# EAGLE schematic motor-shield01 (EAGLE 7.5.0)
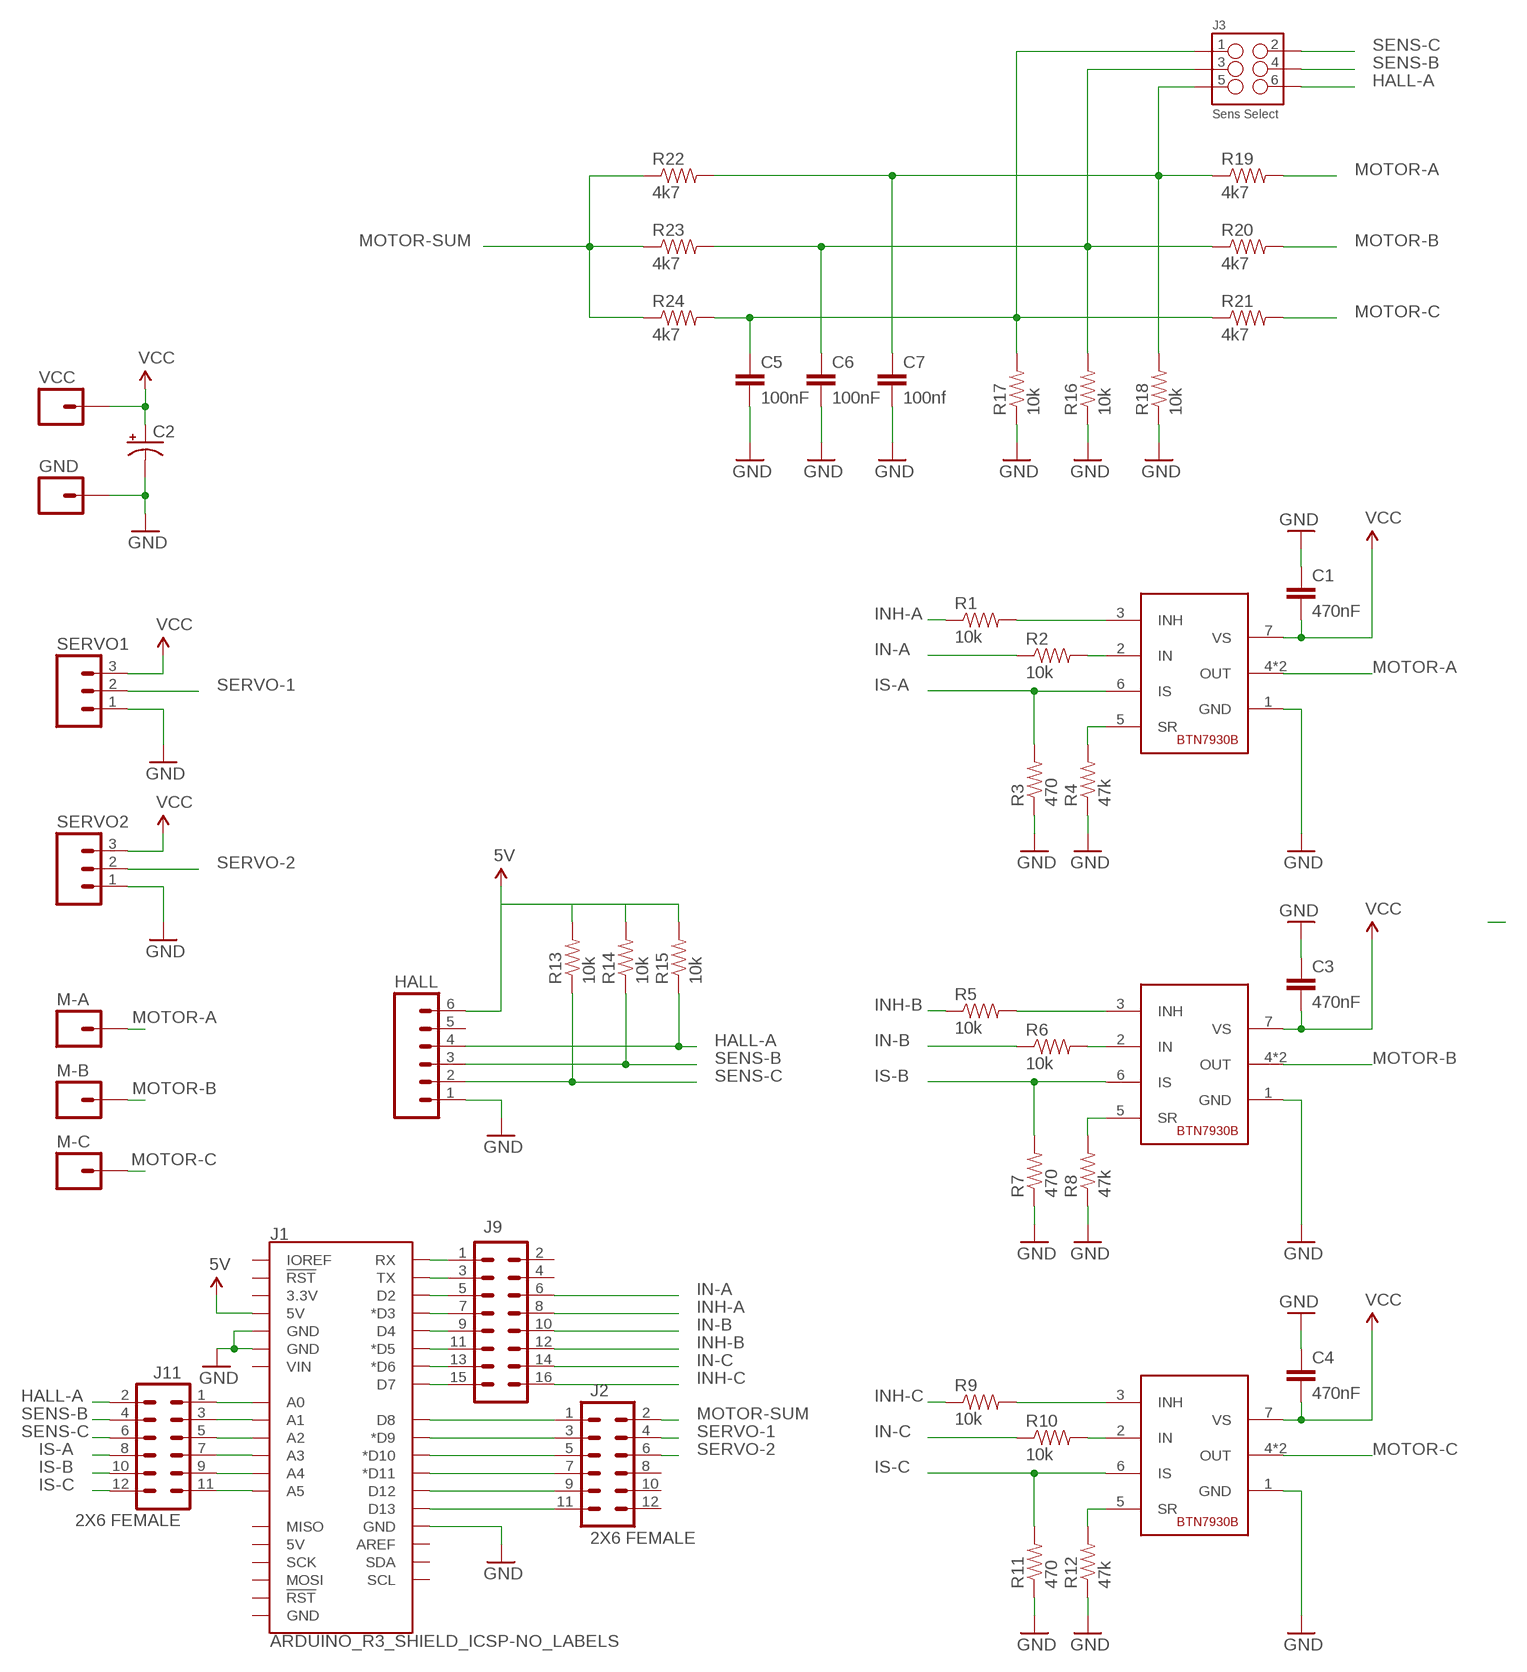
[diagram p0: schematic, sheet 1]

## Parts
C1  470nF  CAPEZ  [CAP-PTH-SMALLEZ]
C2  CAP_POLPTH1  [CPOL-RADIAL-100UF-25V]
C3  470nF  CAPEZ  [CAP-PTH-SMALLEZ]
C4  470nF  CAPEZ  [CAP-PTH-SMALLEZ]
C5  100nF  CAPEZ  [CAP-PTH-SMALLEZ]
C6  100nF  CAPEZ  [CAP-PTH-SMALLEZ]
C7  100nf  CAPEZ  [CAP-PTH-SMALLEZ]
DA  H-Bridge  INF-PG-TO263-7-1_L_1  [INF-PG-TO263-7-1_L_1PRIMARY]
DB  H-Bridge  INF-PG-TO263-7-1_L_1  [INF-PG-TO263-7-1_L_1PRIMARY]
DC  H-Bridge  INF-PG-TO263-7-1_L_1  [INF-PG-TO263-7-1_L_1PRIMARY]
GND  M01SMTRA-256-8-6  [SMTRA-256-8-6]
HALL  M06SMD-1MM  [1X06-1MM]
J1  ARDUINO_R3_SHIELD_ICSP-NO_LABELS  [UNO_R3_SHIELD_ICSP_NOLABELS]
J2  2X6 FEMALE  M06X2PTH_FEMALE  [2X6]
J3  Sens Select  M03X2FEMALE  [2X3]
J9  M08X2  [2X8]
J11  2X6 FEMALE  M06X2PTH_FEMALE  [2X6]
M-A  M01SMTRA-256-8-6  [SMTRA-256-8-6]
M-B  M01SMTRA-256-8-6  [SMTRA-256-8-6]
M-C  M01SMTRA-256-8-6  [SMTRA-256-8-6]
R1  10k  10KOHM-1/4W-1%(PTH)HORIZ  [AXIAL-0.3]
R2  10k  10KOHM-1/4W-1%(PTH)HORIZ  [AXIAL-0.3]
R3  470  10KOHM-1/4W-1%(PTH)HORIZ  [AXIAL-0.3]
R4  47k  10KOHM-1/4W-1%(PTH)HORIZ  [AXIAL-0.3]
R5  10k  10KOHM-1/4W-1%(PTH)HORIZ  [AXIAL-0.3]
R6  10k  10KOHM-1/4W-1%(PTH)HORIZ  [AXIAL-0.3]
R7  470  10KOHM-1/4W-1%(PTH)HORIZ  [AXIAL-0.3]
R8  47k  10KOHM-1/4W-1%(PTH)HORIZ  [AXIAL-0.3]
R9  10k  10KOHM-1/4W-1%(PTH)HORIZ  [AXIAL-0.3]
R10  10k  10KOHM-1/4W-1%(PTH)HORIZ  [AXIAL-0.3]
R11  470  10KOHM-1/4W-1%(PTH)HORIZ  [AXIAL-0.3]
R12  47k  10KOHM-1/4W-1%(PTH)HORIZ  [AXIAL-0.3]
R13  10k  10KOHM-1/4W-1%(PTH)HORIZ  [AXIAL-0.3]
R14  10k  10KOHM-1/4W-1%(PTH)HORIZ  [AXIAL-0.3]
R15  10k  10KOHM-1/4W-1%(PTH)HORIZ  [AXIAL-0.3]
R16  10k  10KOHM-1/4W-1%(PTH)HORIZ  [AXIAL-0.3]
R17  10k  10KOHM-1/4W-1%(PTH)HORIZ  [AXIAL-0.3]
R18  10k  10KOHM-1/4W-1%(PTH)HORIZ  [AXIAL-0.3]
R19  4k7  10KOHM-1/4W-1%(PTH)HORIZ  [AXIAL-0.3]
R20  4k7  10KOHM-1/4W-1%(PTH)HORIZ  [AXIAL-0.3]
R21  4k7  10KOHM-1/4W-1%(PTH)HORIZ  [AXIAL-0.3]
R22  4k7  10KOHM-1/4W-1%(PTH)HORIZ  [AXIAL-0.3]
R23  4k7  10KOHM-1/4W-1%(PTH)HORIZ  [AXIAL-0.3]
R24  4k7  10KOHM-1/4W-1%(PTH)HORIZ  [AXIAL-0.3]
SERVO1  M03PTH  [1X03]
SERVO2  M03PTH  [1X03]
VCC  M01SMTRA-256-8-6  [SMTRA-256-8-6]

## Nets
5V: HALL.6 J1.5V R13.P$2 R14.P$2 R15.P$2
GND: C1.1 C2.2(-) C3.1 C4.1 C5.2 C6.2 C7.2 DA.1(GND) DB.1(GND) DC.1(GND) GND.P$1 HALL.1 J1.GND@0(GND) J1.GND@1(GND) J1.GND@2(GND) R3.P$1 R4.P$1 R7.P$1 R8.P$1 R11.P$1 R12.P$1 R16.P$1 R17.P$1 R18.P$1 SERVO1.1 SERVO2.1
HALL-A: HALL.4 J3.6 J11.2 R15.P$1
IN-A: J9.6 R2.P$1
IN-B: J9.10 R6.P$1
IN-C: J9.14 R10.P$1
INH-A: J9.8 R1.P$1
INH-B: J9.12 R5.P$1
INH-C: J9.16 R9.P$1
IS-A: DA.6(IS) J11.8 R3.P$2
IS-B: DB.6(IS) J11.10 R7.P$2
IS-C: DC.6(IS) J11.12 R11.P$2
MOTOR-A: DA.4(OUT) DA.8(OUT) M-A.P$1 R19.P$2
MOTOR-B: DB.4(OUT) DB.8(OUT) M-B.P$1 R20.P$2
MOTOR-C: DC.4(OUT) DC.8(OUT) M-C.P$1 R21.P$2
MOTOR-SUM: J2.2 R22.P$1 R23.P$1 R24.P$1
N$1: DA.3(INH) R1.P$2
N$2: DA.2(IN) R2.P$2
N$3: DB.3(INH) R5.P$2
N$4: DA.5(SR) R4.P$2
N$5: DB.2(IN) R6.P$2
N$6: DB.5(SR) R8.P$2
N$7: DC.3(INH) R9.P$2
N$8: DC.2(IN) R10.P$2
N$9: DC.5(SR) R12.P$2
N$10: J1.A0 J11.1
N$11: J1.A1 J11.3
N$12: J1.A2 J11.5
N$13: J1.RX J9.1
N$14: J1.TX J9.3
N$15: J1.D2 J9.5
N$16: J1.D3(*D3) J9.7
N$17: J1.D4 J9.9
N$18: J1.D5(*D5) J9.11
N$19: J1.D6(*D6) J9.13
N$20: J1.D7 J9.15
N$21: J1.D8 J2.1
N$22: J1.D9(*D9) J2.3
N$23: J1.D10(*D10) J2.5
N$24: J1.D11(*D11) J2.7
N$25: J1.D12 J2.9
N$26: J1.D13 J2.11
N$31: J1.A3 J11.7
N$32: J1.A4 J11.9
N$33: J1.A5 J11.11
N$42: C5.1 J3.1 R17.P$2 R21.P$1 R24.P$2
N$43: C6.1 J3.3 R16.P$2 R20.P$1 R23.P$2
N$45: C7.1 J3.5 R18.P$2 R19.P$1 R22.P$2
SENS-B: HALL.3 J3.4 J11.4 R14.P$1
SENS-C: HALL.2 J3.2 J11.6 R13.P$1
SERVO-1: J2.4 SERVO1.2
SERVO-2: J2.6 SERVO2.2
VCC: C1.2 C2.1(+) C3.2 C4.2 DA.7(VS) DB.7(VS) DC.7(VS) SERVO1.3 SERVO2.3 VCC.P$1
Unconnected: HALL.5 J1.3.3V J1.5V_ICSP(5V) J1.AREF J1.GND_ICSP(GND) J1.IOREF J1.MISO J1.MOSI J1.RES(!RST!) J1.RST_ICSP(!RST!) J1.SCK J1.SCL J1.SDA J1.VIN J2.8 J2.10 J2.12 J9.2 J9.4

## Library data of the parts
C1 C3-C7 = SparkFun-Capacitors:CAP: Capacitor Standard 0603 ceramic capacitor, and 0.1" leaded capacitor.
C2 = SparkFun-Capacitors:CAP_POL: Capacitor Polarized These are standard SMD and PTH capacitors. Normally 10uF, 47uF, and 100uF in electrolytic and tantalum varieties. Always verify the external diameter of the through hole cap, it varies with capacity, voltage, and manufacturer. The EIA devices should be standard.
DA DB DC = BTN7930B-High Current PN Half Bridge:INF-PG-TO263-7-1_L_1
GND M-A M-B M-C VCC = SparkFun-Connectors:M01: Header 1 Standard 1-pin 0.1" header. Use with straight break away headers (SKU : PRT-00116), right angle break away headers (PRT-00553), swiss pins (PRT-00743), machine pins (PRT-00117), and female headers (PRT-00115). SMTSO-256-ET is a "flush mount" nut for a 4-40 screw. The older package used to be too tight, and did not allow it to sit properly thru the drill hit. The latest (0.165DIA) fits nice and snug.
HALL = SparkFun-Connectors:M06: Header 6 Standard 6-pin 0.1" header. Use with straight break away headers (SKU : PRT-00116), right angle break away headers (PRT-00553), swiss pins (PRT-00743), machine pins (PRT-00117), and female headers (PRT-00115). Molex polarized connector foot print use with SKU : PRT-08094 with associated crimp pins and housings. NOTES ON THE VARIANTS LOCK and LOCK_LONGPADS... This footprint was designed to help hold the alignment of a through-hole component (i.e. 6-pin header) while soldering it into place. You may notice that each hole has been shifted either up or down by 0.005 of an inch from it's more standard position (which is a perfectly straight line). This slight alteration caused the pins (the squares in the middle) to touch the edges of the holes. Because they are alternating, it causes a "brace" to hold the component in place. 0.005 has proven to be the perfect amount of "off-center" position when using our standard breakaway headers. Although looks a little odd when you look at the bare footprint, once you have a header in there, the alteration is very hard to notice. Also,if you push a header all the way into place, it is covered up entirely on the bottom side. This idea of altering the position of holes to aid alignment will be further integrated into the Sparkfun Library for other footprints. It can help hold any component with 3 or more connection pins.
J1 = SparkFun-Boards:ARDUINO_R3_SHIELD_ICSP: Arduino R3 Shield Footprint w/ 6-pin (2x3) ICSP Header
J2 J11 = SparkFun-Connectors:M06X2; PROD_ID: CONN-12423
J3 = SparkFun-Connectors:M03X2: 2x3 .1" header. Shrouded, with keying- CONN-10681 SMT- CONN-11415 Pogo pins- HW-11044; PROD_ID: CONN-11566; VALUE: FEMALE 2x3
J9 = SparkFun-Connectors:M08X2: .1" headers, two rows of 8 each
R1 R2 R5 R6 R9 R10 R13-R18 = SparkFun-Resistors:10KOHM-1/4W-1%(PTH): RES-12183; PROD_ID: RES-12183
R3 R4 R7 R8 R11 R12 R19-R24 = SparkFun-Resistors:10KOHM-1/4W-1%(PTH): RES-12183; PROD_ID: RES-12183; VALUE: 10k
SERVO1 SERVO2 = SparkFun-Connectors:M03: Header 3 Standard 3-pin 0.1" header. Use with straight break away headers (SKU : PRT-00116), right angle break away headers (PRT-00553), swiss pins (PRT-00743), machine pins (PRT-00117), and female headers (PRT-00115). Molex polarized connector foot print use with SKU : PRT-08232 with associated crimp pins and housings.